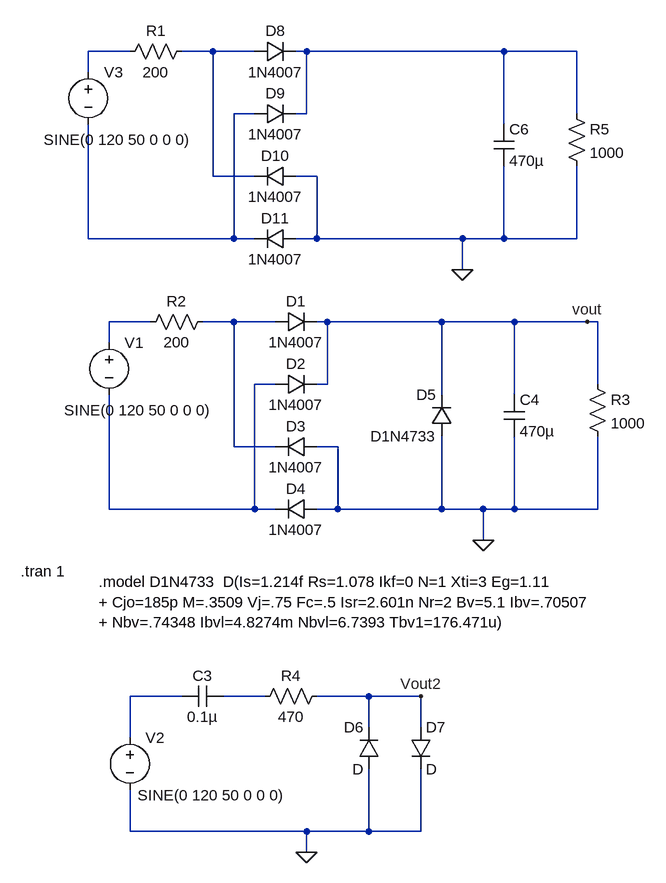
[diagram p0: schematic Capacitor-dropper-circuit.asc]
Capacitor-dropper-circuit.asc, the LTspice schematic file:
Version 4.1
SHEET 1 900 900
WIRE 96 -352 32 -352
WIRE 224 -352 176 -352
WIRE 288 -352 224 -352
WIRE 368 -352 352 -352
WIRE 672 -352 368 -352
WIRE 784 -352 672 -352
WIRE 32 -320 32 -352
WIRE 288 -256 256 -256
WIRE 368 -256 368 -352
WIRE 368 -256 352 -256
WIRE 784 -256 784 -352
WIRE 672 -240 672 -352
WIRE 224 -160 224 -352
WIRE 288 -160 224 -160
WIRE 384 -160 352 -160
WIRE 32 -64 32 -240
WIRE 256 -64 256 -256
WIRE 256 -64 32 -64
WIRE 288 -64 256 -64
WIRE 384 -64 384 -160
WIRE 384 -64 352 -64
WIRE 608 -64 384 -64
WIRE 672 -64 672 -176
WIRE 672 -64 608 -64
WIRE 784 -64 784 -176
WIRE 784 -64 672 -64
WIRE 608 -16 608 -64
WIRE 128 64 64 64
WIRE 256 64 208 64
WIRE 320 64 256 64
WIRE 400 64 384 64
WIRE 576 64 400 64
WIRE 688 64 576 64
WIRE 800 64 688 64
WIRE 816 64 800 64
WIRE 64 96 64 64
WIRE 320 160 288 160
WIRE 400 160 400 64
WIRE 400 160 384 160
WIRE 816 160 816 64
WIRE 576 176 576 64
WIRE 688 176 688 64
WIRE 256 256 256 64
WIRE 320 256 256 256
WIRE 416 256 384 256
WIRE 64 352 64 176
WIRE 288 352 288 160
WIRE 288 352 64 352
WIRE 320 352 288 352
WIRE 416 352 416 256
WIRE 416 352 384 352
WIRE 576 352 576 240
WIRE 576 352 416 352
WIRE 640 352 576 352
WIRE 688 352 688 240
WIRE 688 352 640 352
WIRE 816 352 816 240
WIRE 816 352 688 352
WIRE 640 400 640 352
WIRE 176 640 96 640
WIRE 304 640 240 640
WIRE 464 640 384 640
WIRE 544 640 464 640
WIRE 464 688 464 640
WIRE 544 688 544 640
WIRE 96 704 96 640
WIRE 96 848 96 784
WIRE 368 848 96 848
WIRE 464 848 464 752
WIRE 464 848 368 848
WIRE 544 848 544 752
WIRE 544 848 464 848
WIRE 368 880 368 848
FLAG 800 64 vout
FLAG 544 640 Vout2
FLAG 368 880 0
FLAG 640 400 0
FLAG 608 -16 0
SYMBOL voltage 64 80 R0
WINDOW 3 -69 120 Left 2
WINDOW 123 24 124 Left 2
WINDOW 39 0 0 Left 0
SYMATTR InstName V1
SYMATTR Value SINE(0 120 50 0 0 0)
SYMBOL res 112 80 R270
WINDOW 0 32 56 VTop 2
WINDOW 3 0 56 VBottom 2
SYMATTR InstName R2
SYMATTR Value 200
SYMBOL diode 320 80 R270
WINDOW 0 32 32 VTop 2
WINDOW 3 0 32 VBottom 2
SYMATTR InstName D1
SYMATTR Value 1N4007
SYMBOL diode 320 176 R270
WINDOW 0 32 32 VTop 2
WINDOW 3 0 32 VBottom 2
SYMATTR InstName D2
SYMATTR Value 1N4007
SYMBOL diode 384 240 R90
WINDOW 0 0 32 VBottom 2
WINDOW 3 32 32 VTop 2
SYMATTR InstName D3
SYMATTR Value 1N4007
SYMBOL diode 384 336 R90
WINDOW 0 0 32 VBottom 2
WINDOW 3 32 32 VTop 2
SYMATTR InstName D4
SYMATTR Value 1N4007
SYMBOL diode 592 240 R180
WINDOW 0 24 64 Left 2
WINDOW 3 24 0 Left 2
SYMATTR InstName D5
SYMATTR Value D1N4733
SYMATTR Description Diode
SYMATTR Type diode
SYMBOL res 800 144 R0
SYMATTR InstName R3
SYMATTR Value 1000
SYMBOL voltage 96 688 R0
WINDOW 3 12 104 Left 2
WINDOW 123 24 124 Left 2
WINDOW 39 0 0 Left 0
SYMATTR InstName V2
SYMATTR Value SINE(0 120 50 0 0 0)
SYMBOL cap 240 624 R90
WINDOW 0 0 32 VBottom 2
WINDOW 3 32 32 VTop 2
SYMATTR InstName C3
SYMATTR Value 0.1µ
SYMBOL res 288 656 R270
WINDOW 0 32 56 VTop 2
WINDOW 3 0 56 VBottom 2
SYMATTR InstName R4
SYMATTR Value 470
SYMBOL diode 480 752 R180
WINDOW 0 24 64 Left 2
WINDOW 3 24 0 Left 2
SYMATTR InstName D6
SYMBOL diode 528 688 R0
SYMATTR InstName D7
SYMBOL voltage 32 -336 R0
WINDOW 3 -69 120 Left 2
WINDOW 123 24 124 Left 2
WINDOW 39 0 0 Left 0
SYMATTR InstName V3
SYMATTR Value SINE(0 120 50 0 0 0)
SYMBOL res 80 -336 R270
WINDOW 0 32 56 VTop 2
WINDOW 3 0 56 VBottom 2
SYMATTR InstName R1
SYMATTR Value 200
SYMBOL diode 288 -336 R270
WINDOW 0 32 32 VTop 2
WINDOW 3 0 32 VBottom 2
SYMATTR InstName D8
SYMATTR Value 1N4007
SYMBOL diode 288 -240 R270
WINDOW 0 32 32 VTop 2
WINDOW 3 0 32 VBottom 2
SYMATTR InstName D9
SYMATTR Value 1N4007
SYMBOL diode 352 -176 R90
WINDOW 0 0 32 VBottom 2
WINDOW 3 32 32 VTop 2
SYMATTR InstName D10
SYMATTR Value 1N4007
SYMBOL diode 352 -80 R90
WINDOW 0 0 32 VBottom 2
WINDOW 3 32 32 VTop 2
SYMATTR InstName D11
SYMATTR Value 1N4007
SYMBOL res 768 -272 R0
SYMATTR InstName R5
SYMATTR Value 1000
SYMBOL cap 672 176 R0
SYMATTR InstName C4
SYMATTR Value 470µ
SYMBOL cap 656 -240 R0
SYMATTR InstName C6
SYMATTR Value 470µ
TEXT -72 448 Left 2 !.tran 1
TEXT 48 464 Left 2 !.model D1N4733  D(Is=1.214f Rs=1.078 Ikf=0 N=1 Xti=3 Eg=1.11\n+ Cjo=185p M=.3509 Vj=.75 Fc=.5 Isr=2.601n Nr=2 Bv=5.1 Ibv=.70507\n+ Nbv=.74348 Ibvl=4.8274m Nbvl=6.7393 Tbv1=176.471u)

The netlist it stands for:
* Capacitor-dropper-circuit.asc
V1 N005 N007 SINE(0 120 50 0 0 0)
R2 N005 N006 200
D1 N006 vout 1N4007
D2 N007 vout 1N4007
D3 0 N006 1N4007
D4 0 N007 1N4007
D5 0 vout D1N4733
R3 vout 0 1000
V2 N008 0 SINE(0 120 50 0 0 0)
C3 N009 N008 0.1µ
R4 N009 Vout2 470
D6 0 Vout2 D
D7 Vout2 0 D
V3 N001 N004 SINE(0 120 50 0 0 0)
R1 N001 N002 200
D8 N002 N003 1N4007
D9 N004 N003 1N4007
D10 0 N002 1N4007
D11 0 N004 1N4007
R5 N003 0 1000
C4 vout 0 470µ
C6 N003 0 470µ
.model D D
.lib standard.dio
.tran 1
.model D1N4733  D(Is=1.214f Rs=1.078 Ikf=0 N=1 Xti=3 Eg=1.11
+ Cjo=185p M=.3509 Vj=.75 Fc=.5 Isr=2.601n Nr=2 Bv=5.1 Ibv=.70507
+ Nbv=.74348 Ibvl=4.8274m Nbvl=6.7393 Tbv1=176.471u)
.backanno
.end